# EAGLE design Wind_enc_INSP (EAGLE 6.4)
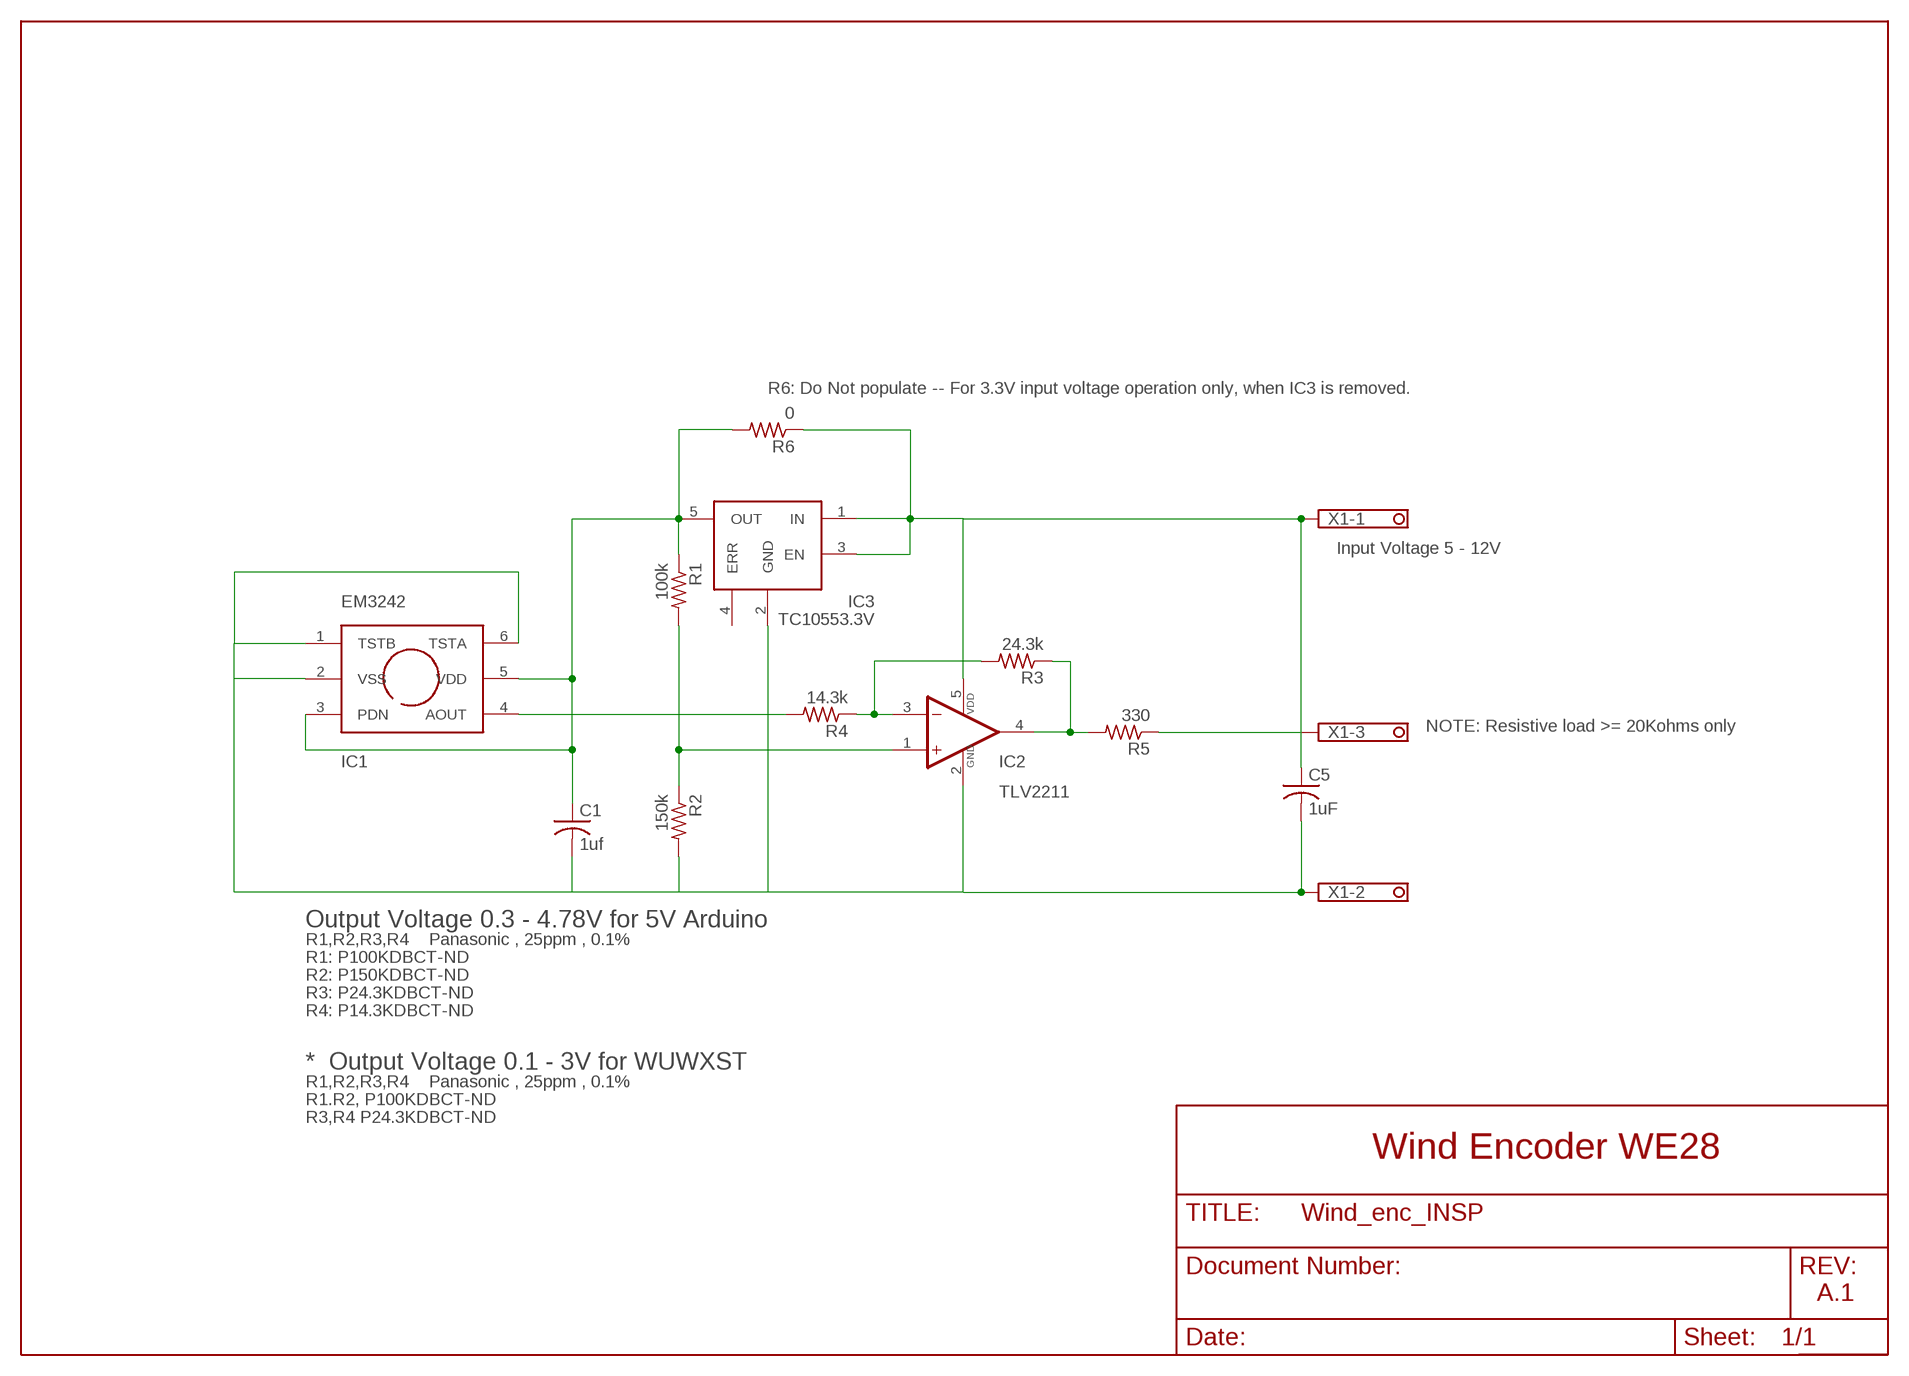
[diagram p0: schematic, sheet 1]

## Parts
C1  1uf  C-USC0805K  [C0805K]
C5  1uF  C-USC0805K  [C0805K]
IC1  EM3242  [EM3242_SPECIAL]
IC2  TLV2211  TLVB2211  [SOT23-5]
IC3  TC10553.3V  [SOT23-5]
R1  100k  R-US_R0603  [R0603]
R2  150k  R-US_R0603  [R0603]
R3  24.3k  R-US_R0603  [R0603]
R4  14.3k  R-US_R0603  [R0603]
R5  330  R-US_R0603  [R0603]
R6  0  R-US_R0603  [R0603]
X1  1751251  [1751251]

## Nets
N$1: C5.1 IC2.5(VDD) IC3.1(IN) IC3.3(EN) R6.1 X1.1
N$2: C1.2 C5.2 IC1.1(TSTB) IC1.2(VSS) IC1.6(TSTA) IC2.2(VDD_GND) IC3.2(GND) R2.2 X1.2
N$3: R5.1 X1.3
N$4: IC1.4(AOUT) R4.2
N$5: C1.1 IC1.3(PDN) IC1.5(VDD) IC3.5(OUT) R1.1 R6.2
N$6: IC2.3(-IN) R3.2 R4.1
N$7: IC2.4(OUT) R3.1 R5.2
N$8: IC2.1(+IN) R1.2 R2.1
Unconnected: IC3.4(ERR)

## Notes on the sheet
- R6: Do Not populate -- For 3.3V input voltage operation only, when IC3 is removed.
- Input Voltage 5 - 12V
- NOTE: Resistive load >= 20Kohms only
- IC2
- Output Voltage 0.3 - 4.78V for 5V Arduino
- R1,R2,R3,R4    Panasonic , 25ppm , 0.1%
- R1: P100KDBCT-ND
- R2: P150KDBCT-ND
- R3: P24.3KDBCT-ND
- R4: P14.3KDBCT-ND
- *  Output Voltage 0.1 - 3V for WUWXST
- R1,R2,R3,R4    Panasonic , 25ppm , 0.1%
- R1.R2, P100KDBCT-ND
- R3,R4 P24.3KDBCT-ND
- Wind Encoder WE28
- A.1

## Library data of the parts
C1 C5 = rcl:C-US: CAPACITOR, American symbol
IC1 = 1AA_Stofer:EM3242: AsahiKasei single chip hall effect rotary encoder with DC out
IC2 = 1AA_Stofer:TLVB2211: TI Rail to Rail LINCMOS op-amp
IC3 = 1AA_Stofer:TC10553.3V
R1-R6 = rcl:R-US_: RESISTOR, American symbol
X1 = con-phoenix-350:1751251: MKDS 1/ 3-3,5 Printklemme Nennstrom: 10 A Bemessungsspannung: 160 V Raster: 3,5 mm Polzahl: 3 Montageart: Löten Anschlussart: Schraubanschluss Anschlussrichtung vom Leiter zur Platine: 0° Source: http://eshop.phoenixcontact.com .. 1751251.pdf; OC_FARNELL: unknown; OC_NEWARK: unknown

## Board
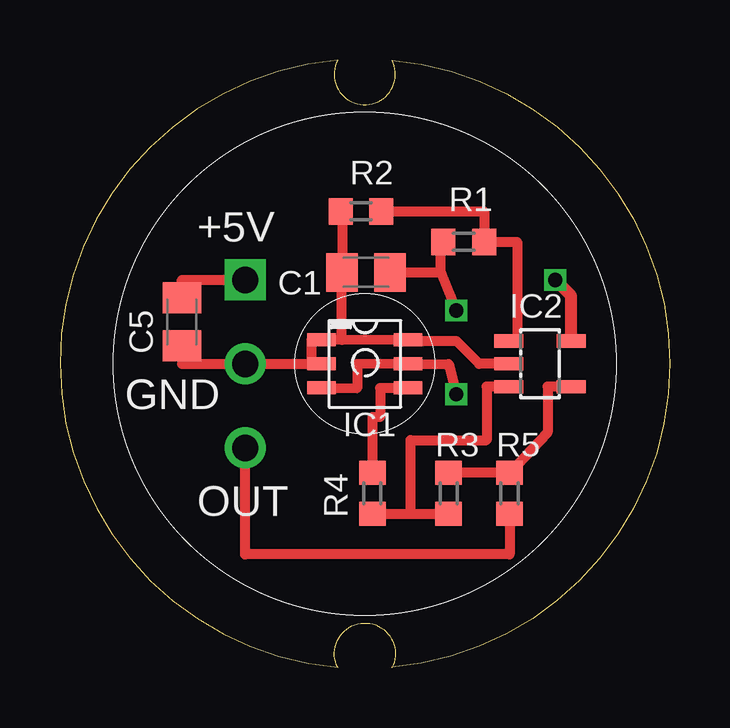
[diagram p1: board, top side]
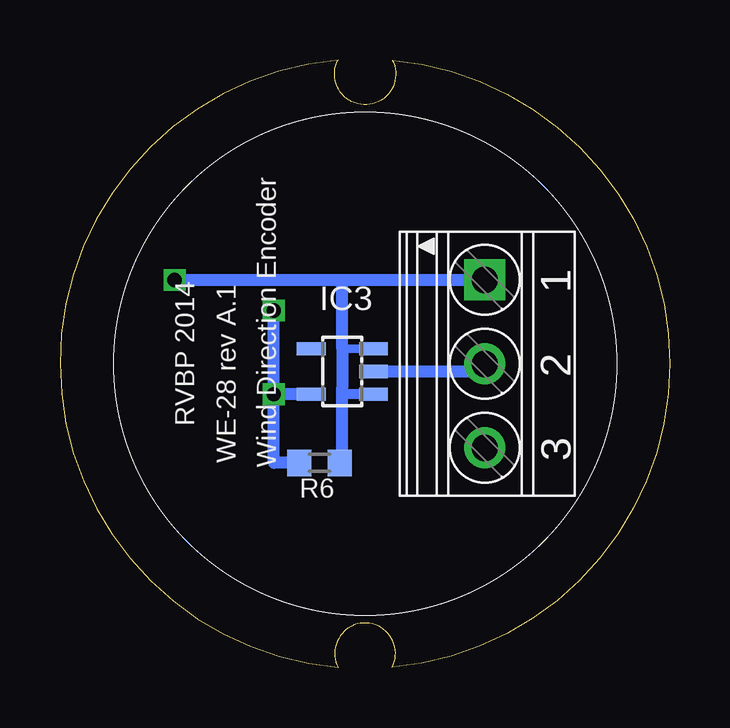
[diagram p2: board, bottom side, seen from below]

Size 25.41 x 25.32 mm. Coordinates in mm from the lower left corner, seen from the top.
Outline: 11.57,25.32 arc170 11.58,0.02
Outline: 11.57,25.32 arc235 13.83,25.32
Outline: 13.83,25.32 arc-170 13.82,0.01
Outline: 11.57,0.02 arc-235 13.83,0
Copper layers (1*16): Top 0.035mm / dielectric 1.5mm / Bottom 0.035mm
Design rules "Elecrow_2-layer_eagle_rule": minimum track width 6mil, minimum drill 12mil, track to track 6mil, track to pad 6mil, pad to pad 6mil, via to via 6mil, smd to smd 0mil, copper to edge 10mil, drill to drill 10mil, minimum pad ring 10mil, minimum via ring 6mil, stop-mask expansion 2mil, vias tented up to drill 100mil, thermal gap 10mil

### Footprints (pad centres in the part's own frame; a part is rotated, then mirrored left to right if it is on the bottom)
C0805K = smd 1.3 x 1.6: 1 -1,0; 2 1,0
EM3242_SPECIAL = smd 1.194 x 0.533: 1 -0.3,2; 2 -0.3,1; 3 -0.3,0; 4 3.3,0; 5 3.3,1; 6 3.3,2
SOT23-5 = smd 0.55 x 1.2: 1 -0.95,-1.3; 2 0,-1.3; 3 0.95,-1.3; 4 0.95,1.3; 5 -0.95,1.3
R0603 = smd 1 x 1.1: 1 -0.85,0; 2 0.85,0
1751251 = drill 1.1 pad 1.7 square: 1 -3.5,-0.1 | drill 1.1 pad 1.7: 2 0,-0.1; 3 3.5,-0.1

### Placement (x,y rotation side)
C1  12.75,16.47 180 top
C5  5.08,14.41 270 top
IC1  11.2,11.66 0 top
IC2  20,12.66 270 top
IC3  13.65,12.35 90 bottom
R1  16.83,17.74 0 top
R2  12.54,19.01 180 top
R3  16.19,7.27 270 top
R4  13.02,7.27 90 top
R5  18.73,7.27 90 top
R6  14.6,8.54 180 bottom
X1  7.62,12.66 270 bottom

### Tracks (layer width: path | path; a pad name or v marks a point on that pad's centre or on a via)
N$1  (via drill 0.6)
  Top 0.356: X1.1
  Top 0.406: C5.1 5.08,16.16 X1.1
  Top 0.508: IC2.5 21.3,15.49 v20.64,16.16
  Bottom 0.356: IC3.3 13.65,13.3 | 13.65,11.71 13.65,11.4 | X1.1
  Bottom 0.406: IC3.1 13.65,11.4 | R6.1 13.65,8.54
  Bottom 0.508: v20.64,16.16 13.65,16.16 | 13.65,16.16 X1.1 | 13.65,16.16 13.65,13.3 13.65,11.71 13.65,8.54
N$2
  Top 0.305: 14.51,13.62 IC1.6
  Top 0.356: 7.72,12.65 X1.2 | 11.69,16.26 11.75,16.26 C1.2 11.7,16.47 | 5.08,12.65 C5.2 | R2.2 11.75,19.01
  Top 0.406: IC1.2 10.48,12.65 | IC2.2 17.46,12.66 16.51,13.62 14.51,13.62 | 10.48,12.65 10.48,13.65 IC1.1 11.75,13.65 | IC1.6 11.75,13.65 | 11.75,13.65 11.75,16.26 | 10.48,12.65 7.72,12.65 5.08,12.65 | 11.75,19.01 C1.2
  Bottom 0.508: IC3.2 8.04,12.35 X1.2
N$3
  Top 0.406: R5.1 18.73,4.73 7.72,4.73 X1.3
N$4
  Top 0.254: IC1.4 14.29,11.65
  Top 0.406: 14.29,11.65 13.33,11.65 13.33,10.44 13.02,10.44 R4.2
N$5  (via drill 0.6)
  Top 0.406: IC1.3 12.38,11.65 12.38,12.65 IC1.5 16.19,12.65 v16.51,11.39 | C1.1 15.87,16.47 | 15.87,16.47 v16.51,14.89 | 15.87,16.47 15.87,17.64 R1.1
  Bottom 0.356: IC3.5
  Bottom 0.508: v16.51,11.39 v16.51,14.89 | IC3.5 v16.51,11.4 v16.51,11.39 | R6.2 16.51,8.54 v16.51,11.39
N$6
  Top 0.406: R4.1 14.6,6.42 | 14.6,6.42 R3.2 | 14.6,6.42 14.6,9.49 17.78,9.49 17.78,11.71 IC2.3
N$7
  Top 0.406: 16.51,8.12 R3.1 R5.2 20.32,9.81 20.32,11.71 IC2.4
N$8
  Top 0.356: IC2.1
  Top 0.406: IC2.1 19.05,13.62 19.05,17.74 R1.2 17.68,19.01 R2.1

### Text on the board
tPlace: +5V | GND | OUT
bPlace: Wind Direction Encoder | RVBP 2014 | WE-28 rev A.1